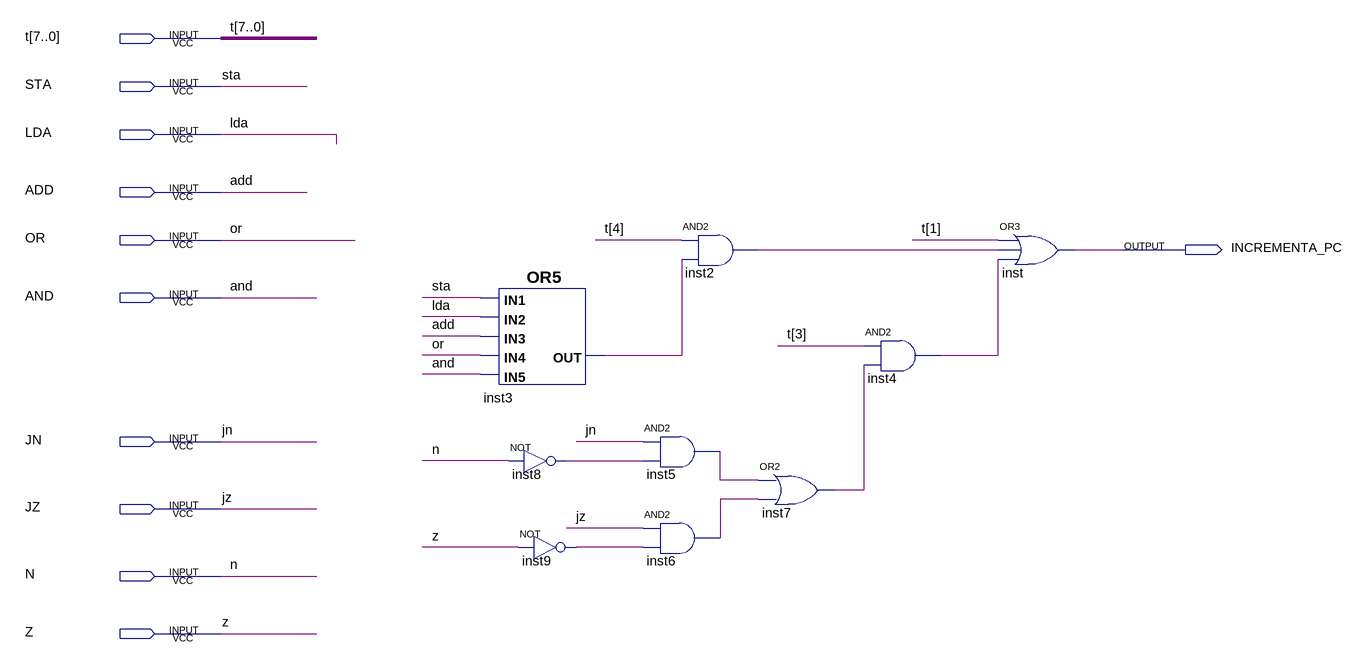
[diagram p0: schematic sheet]
// Quartus schematic INCREMENTA_PC.bdf as structural Verilog: 9 symbols, 11 pins
module INCREMENTA_PC (
  input  [7:0] t,
  input  STA,
  input  LDA,
  input  ADD,
  input  OR,
  input  AND,
  input  JN,
  input  JZ,
  input  N,
  input  Z,
  output INCREMENTA_PC
);

  wire inst2_out, inst3_out, inst4_out, inst5_out, inst6_out, inst7_out, inst8_out, inst9_out;

  or inst3 (inst3_out, STA, LDA, ADD, OR, AND);
  not inst8 (inst8_out, N);
  not inst9 (inst9_out, Z);
  and inst5 (inst5_out, JN, inst8_out);
  and inst6 (inst6_out, JZ, inst9_out);
  and inst2 (inst2_out, t[4], inst3_out);
  or inst7 (inst7_out, inst5_out, inst6_out);
  and inst4 (inst4_out, t[3], inst7_out);
  or inst (INCREMENTA_PC, t[1], inst2_out, inst4_out);
endmodule
